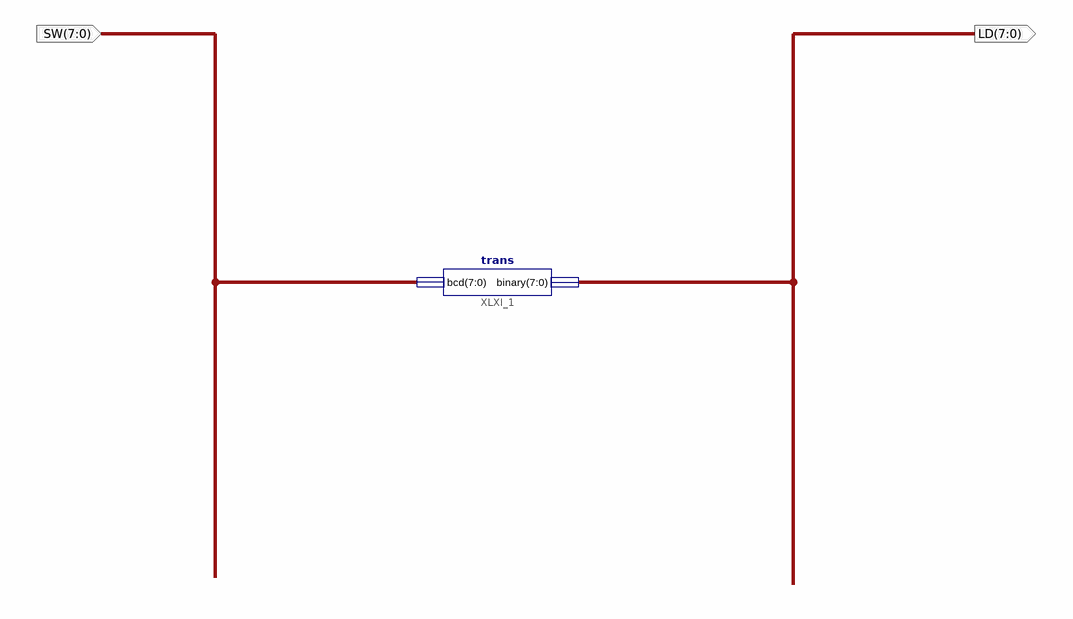
[diagram p0: schematic sheet 1]
// Xilinx ISE schematic lab1.sch (spartan3e) as structural Verilog: 1 symbols, 2 ports
module lab1 (
  input  [7:0] SW,
  output [7:0] LD
);

  trans XLXI_1 (.bcd(SW), .binary(LD));
endmodule
